# Altium project air qulity monitor.PrjPcb
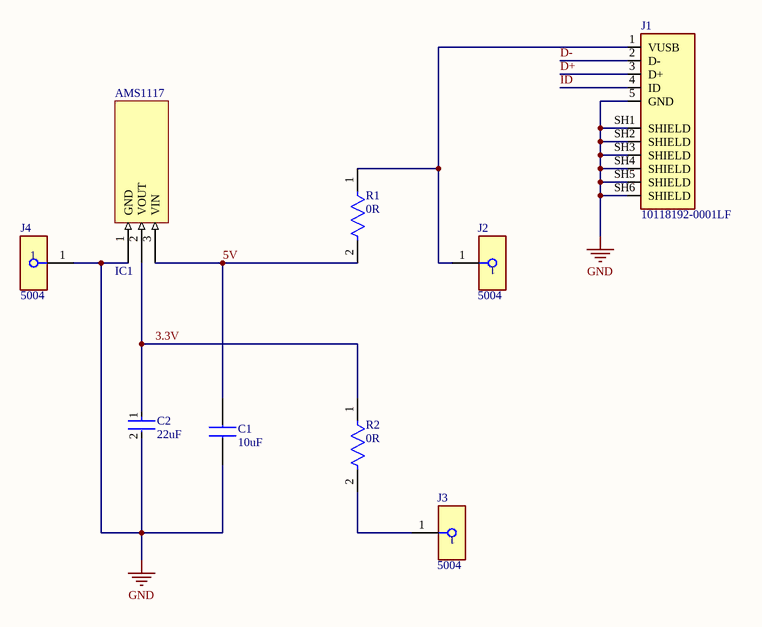
[diagram p0: 5V to 3.3V regulator.SchDoc]
2 sheets, 21 parts. Net scope: global (net labels, ports and power ports of the same name join across sheets).
Board file: air qulity monitor.PcbDoc
Sheets:
  5V to 3.3V regulator.SchDoc
  air qulity monitor.SchDoc

## Sheet 5V to 3.3V regulator.SchDoc: Voltage Regulator
size A4; Organization: TechLabs Global (Pvt) Ltd; DocumentNumber: 2; Revision: 1.0; SheetNumber: 1; SheetTotal: 2

### Parts
AMS1117  IC1  [SOT89-150P350X150-3N]
C1  10uF  [CAPC1005X70N]
C2  22uF  [FP-GRM219-0_2-0_15-IPC_A]
J1  10118192-0001LF  [AMPHENOL_10118192-0001LF]
J2  5004  [FP-5004-MFG]
J3  5004  [FP-5004-MFG]
J4  5004  [FP-5004-MFG]
R1  0R  [FP-RC0402-0_4-IPC_A]
R2  0R  [FP-RC0402-0_4-IPC_A]

### Nets
GND: AMS1117.1(GND) C1.1 C2.2 J1.5(GND) J1.SH1(SHIELD) J1.SH2(SHIELD) J1.SH3(SHIELD) J1.SH4(SHIELD) J1.SH5(SHIELD) J1.SH6(SHIELD) J4.1
3.3V: AMS1117.2(VOUT) C2.1 R2.1
5V: AMS1117.3(VIN) C1.2 R1.2
D+: J1.3(D+)
D-: J1.2(D-)
ID: J1.4(ID)
NetJ1_1: J1.1(VUSB) J2.1 R1.1
NetJ3_1: J3.1 R2.2

### Notes on the sheet
- Title
- Size:
- Date:
- A4
- Number:
- Time:
- Revision:
- Sheet
- of
- File:

### Library data of the parts
AMS1117 = IC?: / 75dB@(120Hz) 1A 1.25V@(1A) ±125℃@(Tj) Fixed 3.3V~3.3V Positive 1 20V SOT-89 Linear Voltage Regulators (LDO) ROHS; Manufacturer: YONGYUTAI; Mfr. Part #: AMS1117-3.3; LCSC Part #: C2904742; Package: SOT-89; Datasheet: https://datasheet.lcsc.com/lcsc/2110121330_YONGYUTAI-AMS1117-3-3_C2904742.pdf
C1 = CL05A106MQ5NUNC: 6.3V 10uF X5R ±20% 0402 Multilayer Ceramic Capacitors MLCC - SMD/SMT ROHS; Manufacturer: Samsung Electro-Mechanics; Mfr. Part #: CL05A106MQ5NUNC; LCSC Part #: 187-CL05A106MQ5NUNC; value: 10uF; Datasheet Link: https://datasheet.datasheetarchive.com/originals/distributors/Datasheets-DGA10/2406160.pdf; Package: 0402
C2 = CMP-06035-056251-1: Chip Multilayer Ceramic Capacitors for General Purpose, 0805, 22uF, X5R, 15%, 20%, 16V; Mfr. Part #: GRM219R61C226ME15L; Manufacturer: Murata Electronics; value: 22uF; Datasheet: https://datasheet.lcsc.com/lcsc/1811141821_Murata-Electronics-GRM219R61C226ME15L_C162295.pdf; LCSC Part #: C162295; Package: 0805
J1 = 10118192-0001LF: Single Port 5 Contact Horizontal Right Angle Shielded Micro B USB 2.0 Connector; Value: *; MP: 10118192-0001LF; Package: None; Availability: Unavailable; Price: None
J2-J4 = CMP-2000-05575-2: PC TEST POINT MINIATURE YELLOW; Manufacturer: Keystone; Datasheet: https://datasheet.lcsc.com/lcsc/2201121200_Keystone-5004_C2906762.pdf; LCSC Part #: C2906762; ComponentLink2URL: https://www.keyelco.com/product-pdf.cfm?p=1313; ComponentLink2Description: Datasheet; Package: 5004; Mfr. Part #: 5004
R1 R2 = CMP-2002-07342-2: RES SMD 0 OHM JUMPER 1/16W 0402; Manufacturer: Yageo; Mfr. Part #: RC0402FR-070RL; value: 0R; Package: 0402; LCSC Part #: C106231; Datasheet: https://www.lcsc.com/product-detail/Chip-Resistor-Surface-Mount_YAGEO-RC0402FR-070RL_C106231.html

## Sheet air qulity monitor.SchDoc
size A4
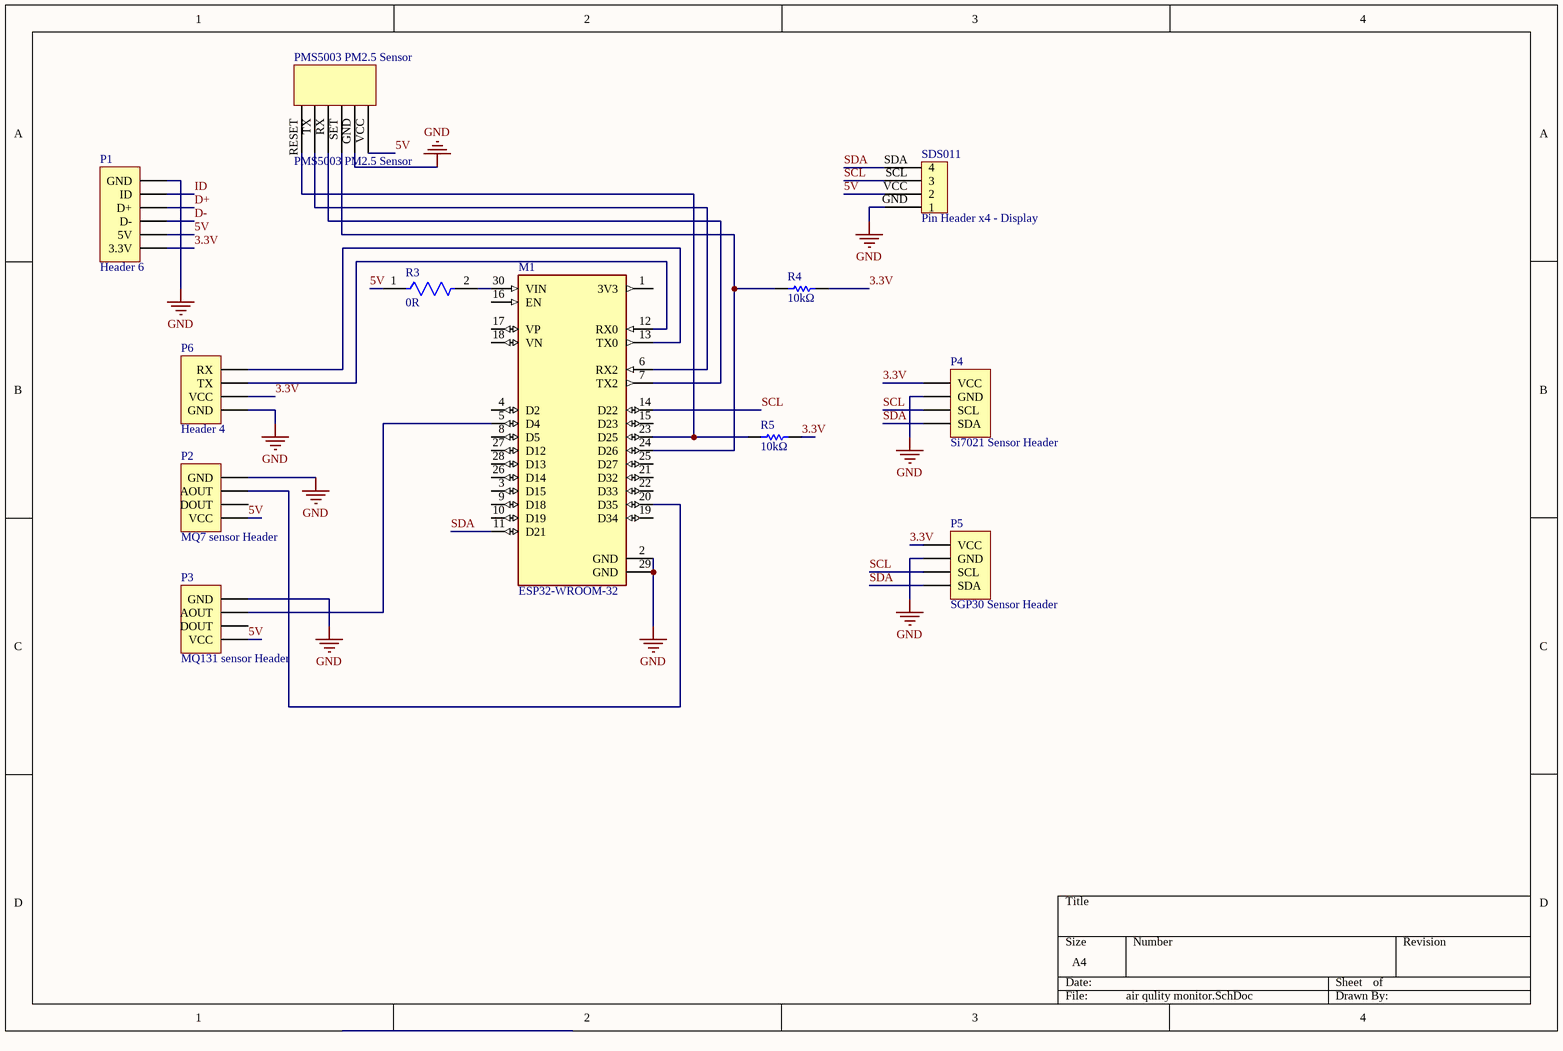
[diagram p1: air qulity monitor.SchDoc]

### Parts
M1  ESP32-WROOM-32  [ESP32-DEVKIT-V1]
P1  Header 6  [HDR1X6]
P2  MQ7 sensor Header  [HDR1X4]
P3  MQ131 sensor Header  [HDR1X4]
P4  Si7021 Sensor Header  [HDR1X4]
P5  SGP30 Sensor Header  [HDR1X4]
P6  Header 4  [HDR1X4]
PMS5003_PM2.5_Sensor  PMS5003 PM2.5 Sensor  [PMS5003 PM2.5 Sensor]
R3  0R  [FP-RC0402-0_4-IPC_A]
R4  10kΩ  [RESC1005X40X25LL05T10]
R5  10kΩ  [RESC1005X40X25LL05T10]
SDS011  Pin Header x4 - Display  [dispay]

### Nets
GND: M1.2(GND) M1.29(GND) P1.6(GND) P2.4(GND) P3.4(GND) P4.2(GND) P5.2(GND) P6.1(GND) PMS5003_PM2.5_Sensor.GND SDS011.GND(1)
3.3V : P1.1(3.3V) P4.1(VCC) P5.1(VCC) P6.2(VCC) R4.2 R5.2  [project net 3.3V]
5V: P1.2(5V) P2.1(VCC) P3.1(VCC) PMS5003_PM2.5_Sensor.VCC R3.1 SDS011.VCC(2)
D+: P1.4(D+)
D-: P1.3(D-)
ID: P1.5(ID)
SCL: M1.14(D22) P4.3(SCL) P5.3(SCL) SDS011.SCL(3)
SDA: M1.11(D21) P4.4(SDA) P5.4(SDA) SDS011.SDA(4)
NetM1_5: M1.5(D4) P3.3(AOUT)
NetM1_6: M1.6(RX2) PMS5003_PM2.5_Sensor.TX
NetM1_7: M1.7(TX2) PMS5003_PM2.5_Sensor.RX
NetM1_12: M1.12(RX0) P6.3(TX)
NetM1_13: M1.13(TX0) P6.4(RX)
NetM1_20: M1.20(D35) P2.3(AOUT)
NetM1_23: M1.23(D25) PMS5003_PM2.5_Sensor.RESET R5.1
NetM1_24: M1.24(D26) PMS5003_PM2.5_Sensor.SET R4.1
NetM1_30: M1.30(VIN) R3.2

Not connected (* = marked no-connect by the designer): M1 1(3V3) 3(D15) 4(D2) 8(D5) 9(D18) 10(D19) 15(D23) 16(EN) 17(VP) 18(VN) 19(D34) 21(D32) 22(D33) 25(D27) 26(D14) 27(D12) 28(D13); P2 2(DOUT); P3 2(DOUT)

### Library data of the parts
M1 = ESP32-DEVKIT-V1: Dual core, Wi-Fi: 2.4 GHz up to 150 Mbits/s,BLE (Bluetooth Low Energy) and legacy Bluetooth, 32 bits, Up to 240 MHz
P1 = Header 6: Header, 6-Pin; LatestRevisionDate: 17-Jul-2002; LatestRevisionNote: Re-released for DXP Platform.; Publisher: Altium Limited
P2-P6 = Header 4: Header, 4-Pin; LatestRevisionDate: 17-Jul-2002; LatestRevisionNote: Re-released for DXP Platform.; Publisher: Altium Limited
R3 = CMP-2002-07342-2: as R1 on sheet 5V to 3.3V regulator; value: 0R; Package: 0402; LCSC Part #: C106231; Datasheet: https://www.lcsc.com/product-detail/Chip-Resistor-Surface-Mount_YAGEO-RC0402FR-070RL_C106231.html
R4 R5 = CMP-2002-07353-1: 62.5mW 50V ±100ppm/℃ ±1% -55℃~+155℃ 10kΩ 0402 Chip Resistor - Surface Mount ROHS; Mfr. Part #: RC0402FR-0710KL; Manufacturer: Yageo / Phycomp; Datasheet: https://datasheet.lcsc.com/lcsc/1809301715_YAGEO-RC0402FR-0710KL_C60490.pdf; LCSC Part #: C60490; Package: 0402; value: 10kΩ

## Nets that join several sheets
GND: 5V to 3.3V regulator (11 pins), air qulity monitor (10 pins)
3.3V: 5V to 3.3V regulator (AMS1117.2 C2.1 R2.1), air qulity monitor (6 pins)
5V: 5V to 3.3V regulator (AMS1117.3 C1.2 R1.2), air qulity monitor (6 pins)
D+: 5V to 3.3V regulator (J1.3), air qulity monitor (P1.4)
D-: 5V to 3.3V regulator (J1.2), air qulity monitor (P1.3)
ID: 5V to 3.3V regulator (J1.4), air qulity monitor (P1.5)